# EAGLE schematic LimitSwitch (EAGLE 9.6.2)
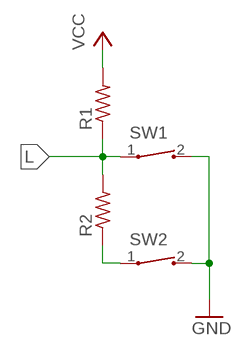
[diagram p0: schematic, sheet 1]

## Parts
R1  R-US_0204/7  [0204/7]
R2  R-US_0204/7  [0204/7]
SW1  CT10-XXXX-A2  [CT10-XXXX-A2]
SW2  CT10-XXXX-A2  [CT10-XXXX-A2]

## Nets
GND: SW1.2 SW2.2
L: R1.1 R2.2 SW1.1
N$2: R2.1 SW2.1
VCC: R1.2

## Library data of the parts
R1 R2 = rcl:R-US_: RESISTOR, American symbol; SPICEPREFIX: R
SW1 SW2 = switch-coto:CT10-XXXX-: CT10 Series Molded Switch Source: www.cotorelay.com .. Coto_Technology__CT10-1530-G1.pdf